# Altium project MiniPC MB GOST.PrjPcb (part 30 of 31)
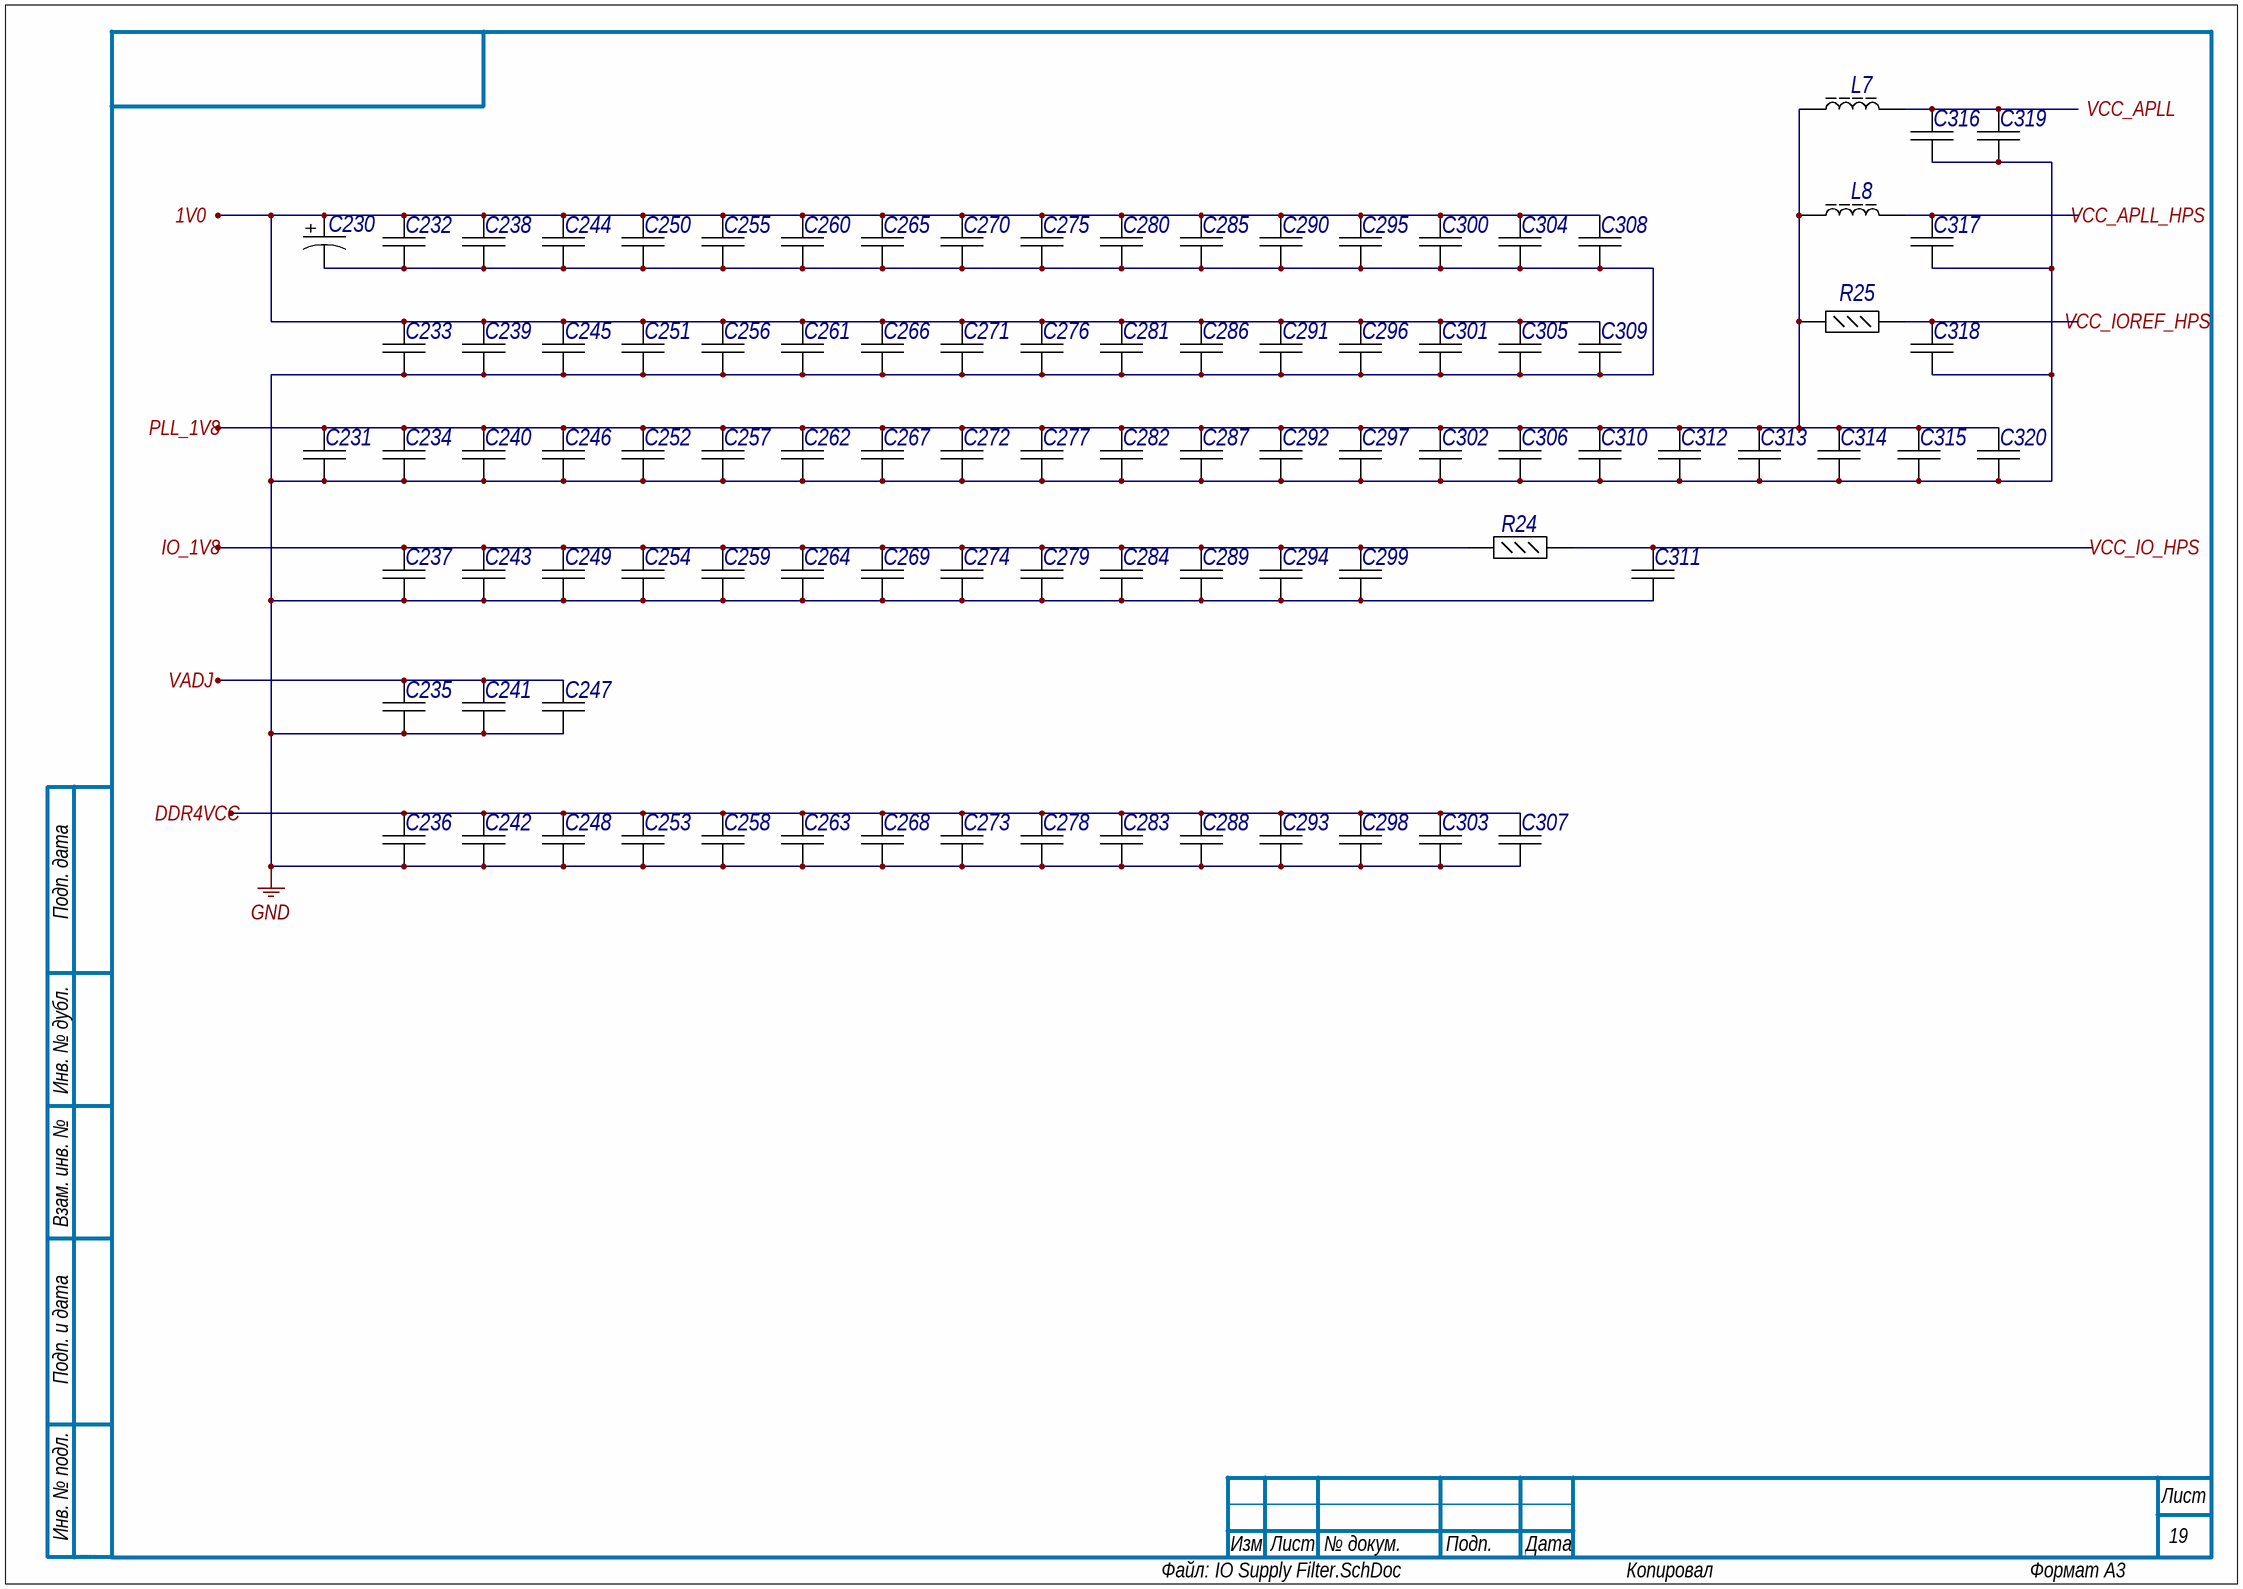
[diagram p57: IO Supply Filter.SchDoc]

## Sheet IO Supply Filter.SchDoc (continued)

### Library data of the parts (continued)
C320 = E22: Chip Capacitor, 100 nF, +/- 10%, 6.3 V, -55 to 85 degC, 0201 (0603 Metric), RoHS, Tape and Reel; Manufacturer: Basic Passives; Тип элемента: Конденсатор; Capacitance: 100 nF; Case\/Package: 0201; Type (Capacitors): X5R; Voltage Rating: 6.3 V; Voltage Rating (DC): 3 V; Old_des: C444; New_des: C320; UID: E22; Component Kind: Standard; Case Code (Imperial): 0201; Case Code (Metric): 0603; ComponentLink1Description: Manufacturer URL; ComponentLink1URL: http://www.murata.com/; ComponentLink2Description: Datasheet; ComponentLink2URL: http://search.murata.co.jp/Ceramy/image/img/A01X/G101/ENG/GRM033R60J104KE19-01.pdf; DatasheetVersion: 03/2016; Length: 0.6 mm; Max Operating Temperature: 85 degC; Min Operating Temperature: -55 degC; Mounting Technology: Surface Mount; Package Quantity: 15000; PackageDescription: 2-Pin Surface Mount Device, Body 0.6 x 0.3 mm; Packaging: Tape and Reel; PartNumber: GRM033R60J104KE19D; RoHSCompliant: true; Tolerance: 10%; Width: 0.3 mm; Height: 0.3 mm; Mount: Surface Mount; PackageReference: 0201; Pins: 2; Radiation Hardening: No; REACH SVHC: No SVHC
L7 = E45: SMD EMI Suppression Ferrite Bead WE-CBF, Z = 30 Ohm; Тип элемента: Ферритовый дроссель; Impedance: 30 Ohm; Old_des: L15; New_des: L7; UID: E45; Component Kind: Standard; ComponentLink1Description: Manufacturer Link; ComponentLink1URL: http://www.we-online.com; ComponentLink2Description: Datasheet; ComponentLink2URL: http://www.we-online.de/katalog/media/pdf/742792609.pdf; DatasheetVersion: Dec-2005; PackageDescription: Chip Inductor, 2-Leads, Body 1.6 x 0.8 mm; PackageReference: SMD-0603; PackageVersion: 2009
L8 = E45: SMD EMI Suppression Ferrite Bead WE-CBF, Z = 30 Ohm; Тип элемента: Ферритовый дроссель; Impedance: 30 Ohm; Old_des: L16; New_des: L8; UID: E45; Component Kind: Standard; ComponentLink1Description: Manufacturer Link; ComponentLink1URL: http://www.we-online.com; ComponentLink2Description: Datasheet; ComponentLink2URL: http://www.we-online.de/katalog/media/pdf/742792609.pdf; DatasheetVersion: Dec-2005; PackageDescription: Chip Inductor, 2-Leads, Body 1.6 x 0.8 mm; PackageReference: SMD-0603; PackageVersion: 2009
R24 = E64: Chip Resistor, 0 mOhm, +/- 5%, 100 mW, -55 to 155 degC, 0402 (1005 Metric), RoHS, Tape and Reel; Manufacturer: Basic Passives; Тип элемента: Резистор; Case\/Package: 0402; Voltage Rating: 50 V; Power Rating: 100 mW; Resistance: 0 mOhm; Old_des: R326; New_des: R24; UID: E64; Component Kind: Standard; Case Code (Imperial): 0402; Case Code (Metric): 1005; ComponentLink1Description: Manufacturer URL; ComponentLink1URL: http://www.panasonic.com/; ComponentLink2Description: Datasheet; ComponentLink2URL: http://industrial.panasonic.com/cdbs/www-data/pdf/RDA0000/AOA0000C84.pdf; DatasheetVersion: 03/2015; Length: 1 mm; Max Operating Temperature: 155 degC; Min Operating Temperature: -55 degC; Mounting Technology: Surface Mount; Package Quantity: 10000; PackageDescription: 2-Pin Surface Mount Device, Body 1 x 0.5 mm; Packaging: Tape and Reel; PartNumber: ERJ-2GE0R00X; RoHSCompliant: true; Tolerance: 5%; Width: 0.5 mm; Height: 0.35 mm; Mount: Surface Mount; PackageReference: 0402; Pins: 2; Radiation Hardening: No; REACH SVHC: Unknown
R25 = E64: Chip Resistor, 0 mOhm, +/- 5%, 100 mW, -55 to 155 degC, 0402 (1005 Metric), RoHS, Tape and Reel; Manufacturer: Basic Passives; Тип элемента: Резистор; Case\/Package: 0402; Voltage Rating: 50 V; Power Rating: 100 mW; Resistance: 0 mOhm; Old_des: R327; New_des: R25; UID: E64; Component Kind: Standard; Case Code (Imperial): 0402; Case Code (Metric): 1005; ComponentLink1Description: Manufacturer URL; ComponentLink1URL: http://www.panasonic.com/; ComponentLink2Description: Datasheet; ComponentLink2URL: http://industrial.panasonic.com/cdbs/www-data/pdf/RDA0000/AOA0000C84.pdf; DatasheetVersion: 03/2015; Length: 1 mm; Max Operating Temperature: 155 degC; Min Operating Temperature: -55 degC; Mounting Technology: Surface Mount; Package Quantity: 10000; PackageDescription: 2-Pin Surface Mount Device, Body 1 x 0.5 mm; Packaging: Tape and Reel; PartNumber: ERJ-2GE0R00X; RoHSCompliant: true; Tolerance: 5%; Width: 0.5 mm; Height: 0.35 mm; Mount: Surface Mount; PackageReference: 0402; Pins: 2; Radiation Hardening: No; REACH SVHC: Unknown

## Sheet P_RAM_integr.SchDoc
size 420 x 297 mm; Author: ALTIUM GOSTBOM2.0 KEV; SheetNumber: 27; SheetTotal: 48
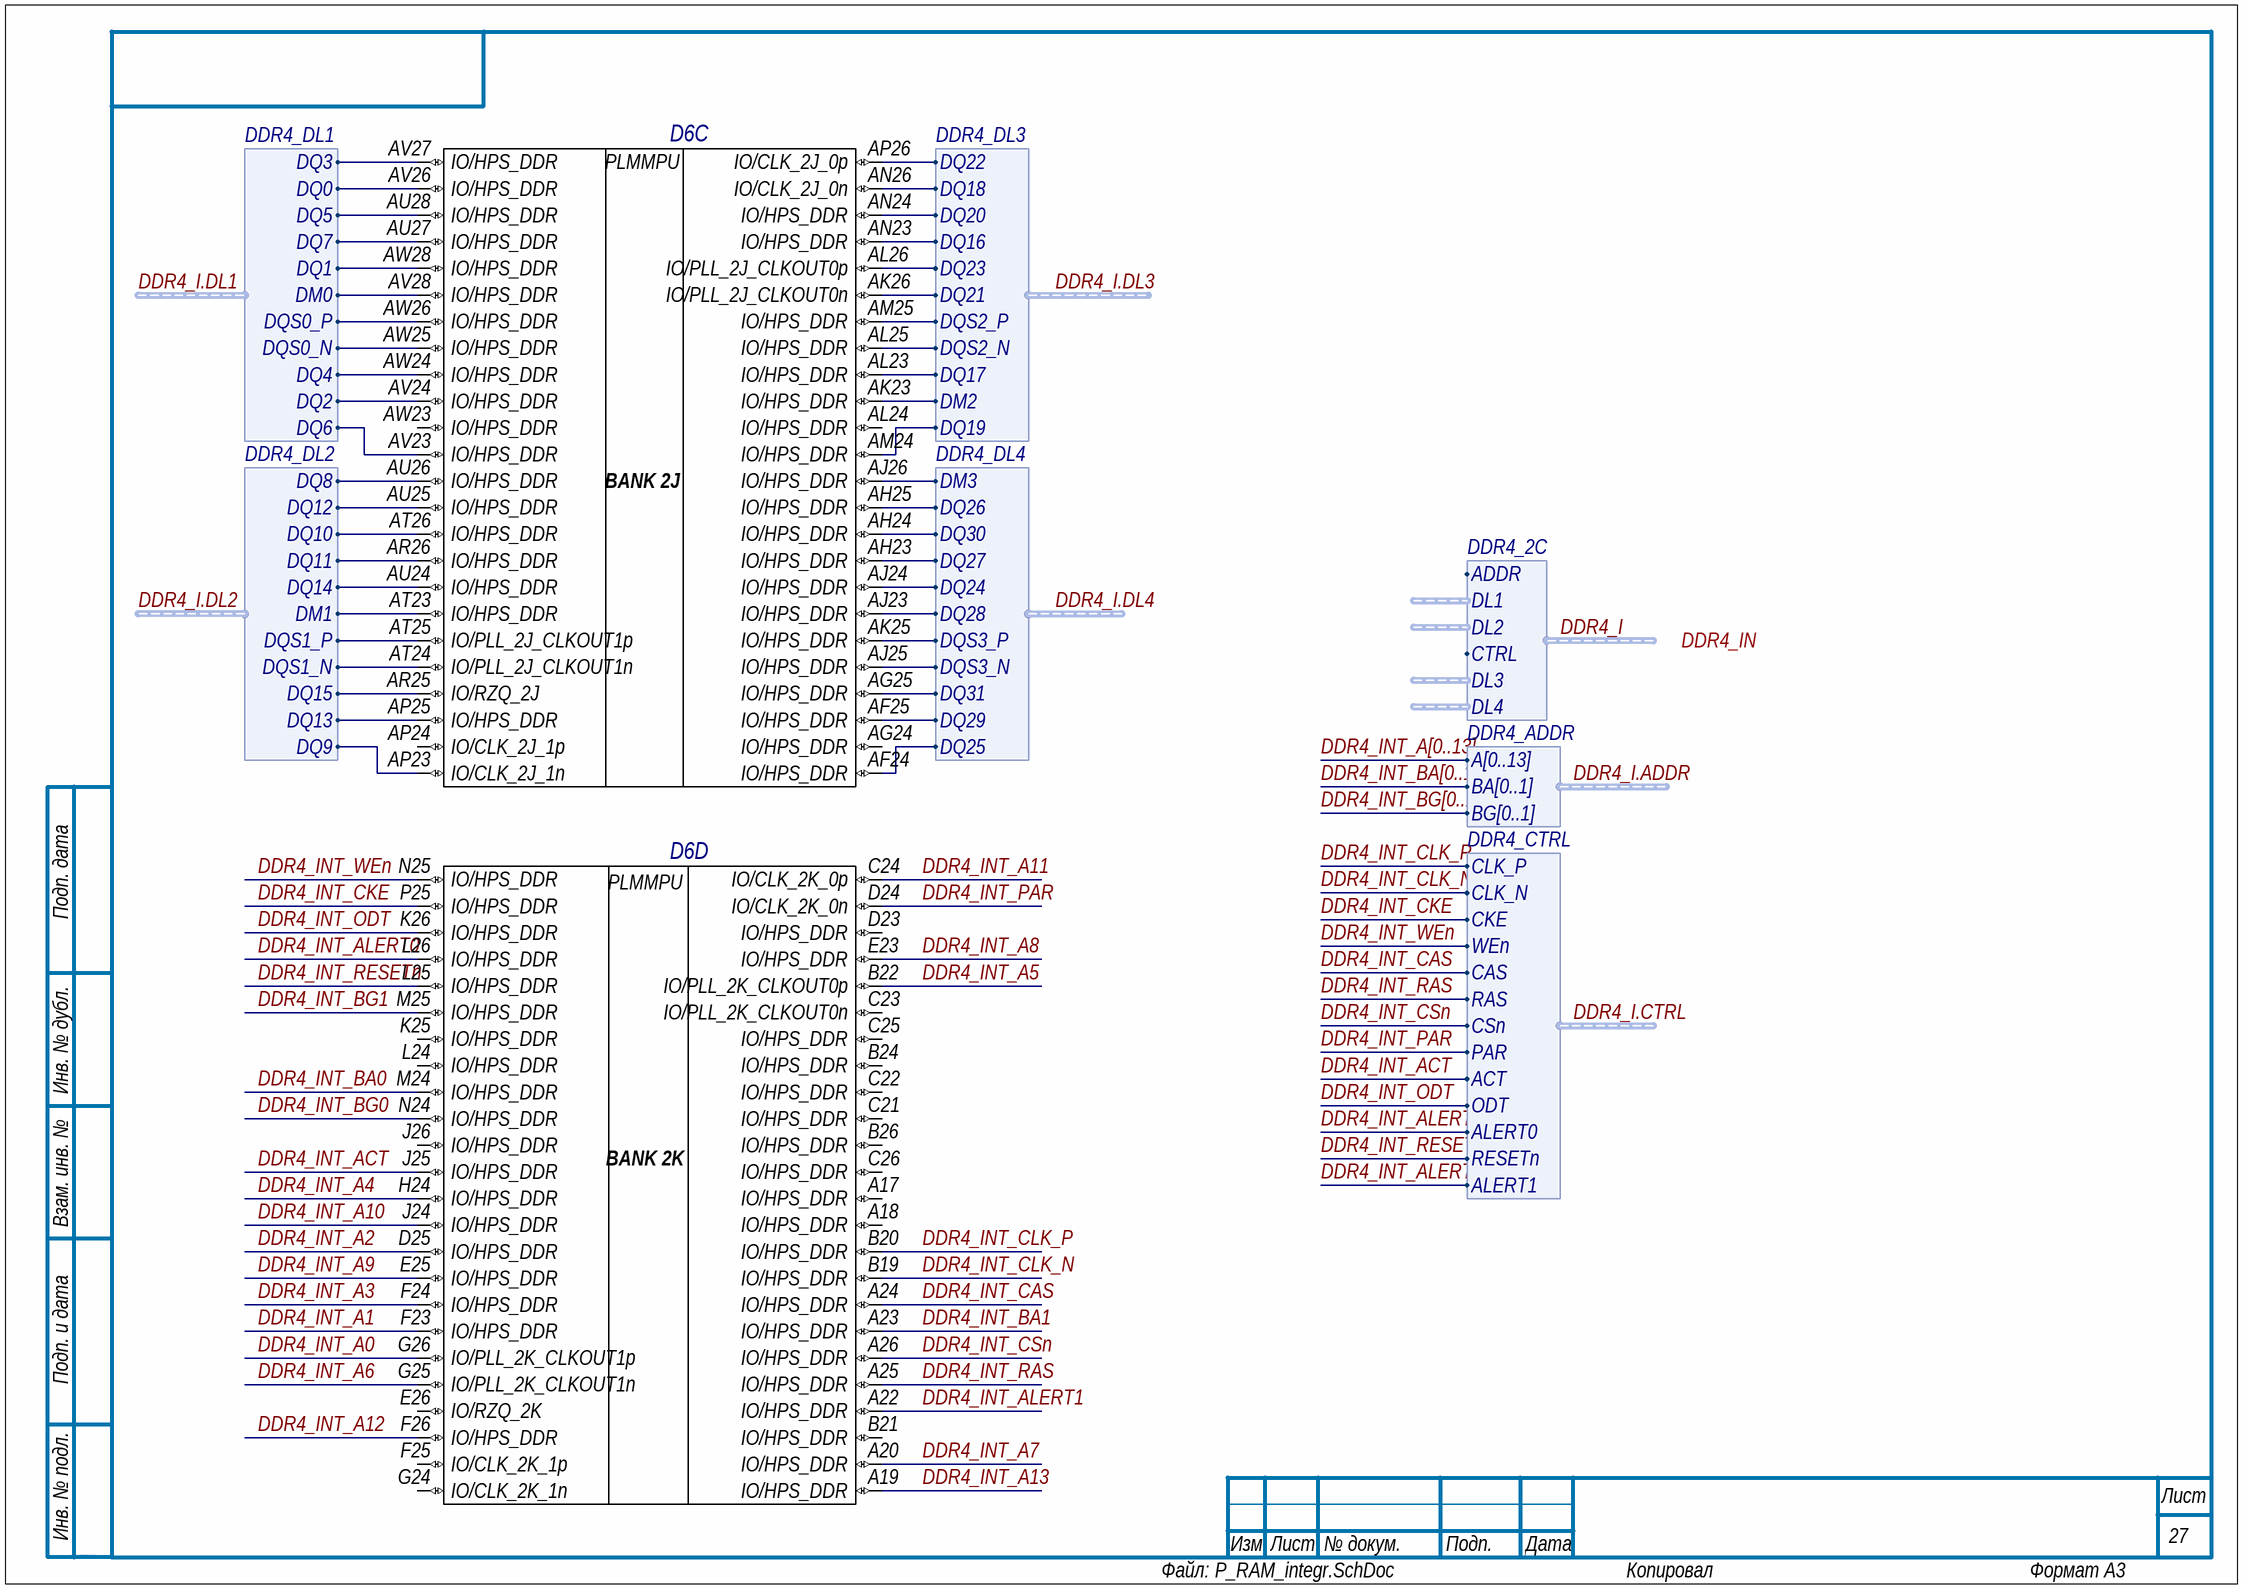
[diagram p37: P_RAM_integr.SchDoc]

### Parts
D6  10AS066N3F40E2SGE2  [ALTR-FBGA1517_A-350]  (value not drawn)  (parts C,D of 39)

### Ports
DDR4_IN (harness DDR4_2C)

### Harnesses
DDR4_2C: ADDR, DL1, DL2, CTRL, DL3, DL4
DDR4_ADDR: A[0..13], BA[0..1], BG[0..1]
DDR4_CTRL: CLK_P, CLK_N, CKE, WEn, CAS, RAS, CSn, PAR, ACT, ODT, ALERT0, RESETn, ALERT1
DDR4_DL1: DQ0, DQ1, DQ2, DQ3, DQ4, DQ5, DQ6, DQ7, DM0, DQS0_P, DQS0_N
DDR4_DL2: DQ8, DQ9, DQ10, DQ11, DQ12, DQ13, DQ14, DQ15, DM1, DQS1_P, DQS1_N
DDR4_DL3: DQ16, DQ17, DQ18, DQ19, DQ20, DQ21, DQ22, DQ23, DM2, DQS2_P, DQS2_N
DDR4_DL4: DQ24, DQ25, DQ26, DQ27, DQ28, DQ29, DQ30, DQ31, DM3, DQS3_P, DQS3_N

### Nets
DDR4_I.DL1.DM0: D6.AV28(IO/HPS_DDR) ; harness DDR4_DL1.DM0
DDR4_I.DL1.DQ0: D6.AV26(IO/HPS_DDR) ; harness DDR4_DL1.DQ0
DDR4_I.DL1.DQ1: D6.AW28(IO/HPS_DDR) ; harness DDR4_DL1.DQ1
DDR4_I.DL1.DQ2: D6.AV24(IO/HPS_DDR) ; harness DDR4_DL1.DQ2
DDR4_I.DL1.DQ3: D6.AV27(IO/HPS_DDR) ; harness DDR4_DL1.DQ3
DDR4_I.DL1.DQ4: D6.AW24(IO/HPS_DDR) ; harness DDR4_DL1.DQ4
DDR4_I.DL1.DQ5: D6.AU28(IO/HPS_DDR) ; harness DDR4_DL1.DQ5
DDR4_I.DL1.DQ6: D6.AV23(IO/HPS_DDR) ; harness DDR4_DL1.DQ6
DDR4_I.DL1.DQ7: D6.AU27(IO/HPS_DDR) ; harness DDR4_DL1.DQ7
DDR4_I.DL1.DQS0_N: D6.AW25(IO/HPS_DDR) ; harness DDR4_DL1.DQS0_N
DDR4_I.DL1.DQS0_P: D6.AW26(IO/HPS_DDR) ; harness DDR4_DL1.DQS0_P
DDR4_I.DL2.DM1: D6.AT23(IO/HPS_DDR) ; harness DDR4_DL2.DM1
DDR4_I.DL2.DQ8: D6.AU26(IO/HPS_DDR) ; harness DDR4_DL2.DQ8
DDR4_I.DL2.DQ9: D6.AP23(IO/CLK_2J_1n) ; harness DDR4_DL2.DQ9
DDR4_I.DL2.DQ10: D6.AT26(IO/HPS_DDR) ; harness DDR4_DL2.DQ10
DDR4_I.DL2.DQ11: D6.AR26(IO/HPS_DDR) ; harness DDR4_DL2.DQ11
DDR4_I.DL2.DQ12: D6.AU25(IO/HPS_DDR) ; harness DDR4_DL2.DQ12
DDR4_I.DL2.DQ13: D6.AP25(IO/HPS_DDR) ; harness DDR4_DL2.DQ13
DDR4_I.DL2.DQ14: D6.AU24(IO/HPS_DDR) ; harness DDR4_DL2.DQ14
DDR4_I.DL2.DQ15: D6.AR25(IO/RZQ_2J) ; harness DDR4_DL2.DQ15
DDR4_I.DL2.DQS1_N: D6.AT24(IO/PLL_2J_CLKOUT1n) ; harness DDR4_DL2.DQS1_N
DDR4_I.DL2.DQS1_P: D6.AT25(IO/PLL_2J_CLKOUT1p) ; harness DDR4_DL2.DQS1_P
DDR4_I.DL3.DM2: D6.AK23(IO/HPS_DDR) ; harness DDR4_DL3.DM2
DDR4_I.DL3.DQ16: D6.AN23(IO/HPS_DDR) ; harness DDR4_DL3.DQ16
DDR4_I.DL3.DQ17: D6.AL23(IO/HPS_DDR) ; harness DDR4_DL3.DQ17
DDR4_I.DL3.DQ18: D6.AN26(IO/CLK_2J_0n) ; harness DDR4_DL3.DQ18
DDR4_I.DL3.DQ19: D6.AM24(IO/HPS_DDR) ; harness DDR4_DL3.DQ19
DDR4_I.DL3.DQ20: D6.AN24(IO/HPS_DDR) ; harness DDR4_DL3.DQ20
DDR4_I.DL3.DQ21: D6.AK26(IO/PLL_2J_CLKOUT0n) ; harness DDR4_DL3.DQ21
DDR4_I.DL3.DQ22: D6.AP26(IO/CLK_2J_0p) ; harness DDR4_DL3.DQ22
DDR4_I.DL3.DQ23: D6.AL26(IO/PLL_2J_CLKOUT0p) ; harness DDR4_DL3.DQ23
DDR4_I.DL3.DQS2_N: D6.AL25(IO/HPS_DDR) ; harness DDR4_DL3.DQS2_N
DDR4_I.DL3.DQS2_P: D6.AM25(IO/HPS_DDR) ; harness DDR4_DL3.DQS2_P
DDR4_I.DL4.DM3: D6.AJ26(IO/HPS_DDR) ; harness DDR4_DL4.DM3
DDR4_I.DL4.DQ24: D6.AJ24(IO/HPS_DDR) ; harness DDR4_DL4.DQ24
DDR4_I.DL4.DQ25: D6.AF24(IO/HPS_DDR) ; harness DDR4_DL4.DQ25
DDR4_I.DL4.DQ26: D6.AH25(IO/HPS_DDR) ; harness DDR4_DL4.DQ26
DDR4_I.DL4.DQ27: D6.AH23(IO/HPS_DDR) ; harness DDR4_DL4.DQ27
DDR4_I.DL4.DQ28: D6.AJ23(IO/HPS_DDR) ; harness DDR4_DL4.DQ28
DDR4_I.DL4.DQ29: D6.AF25(IO/HPS_DDR) ; harness DDR4_DL4.DQ29
DDR4_I.DL4.DQ30: D6.AH24(IO/HPS_DDR) ; harness DDR4_DL4.DQ30
DDR4_I.DL4.DQ31: D6.AG25(IO/HPS_DDR) ; harness DDR4_DL4.DQ31
DDR4_I.DL4.DQS3_N: D6.AJ25(IO/HPS_DDR) ; harness DDR4_DL4.DQS3_N
DDR4_I.DL4.DQS3_P: D6.AK25(IO/HPS_DDR) ; harness DDR4_DL4.DQS3_P
DDR4_INT_A0: D6.G26(IO/PLL_2K_CLKOUT1p)  [project net DDR4_INT_A0_27]
DDR4_INT_A1: D6.F23(IO/HPS_DDR)  [project net DDR4_INT_A1_27]
DDR4_INT_A2: D6.D25(IO/HPS_DDR)  [project net DDR4_INT_A2_27]
DDR4_INT_A3: D6.F24(IO/HPS_DDR)  [project net DDR4_INT_A3_27]
DDR4_INT_A4: D6.H24(IO/HPS_DDR)  [project net DDR4_INT_A4_27]
DDR4_INT_A5: D6.B22(IO/PLL_2K_CLKOUT0p)  [project net DDR4_INT_A5_27]
DDR4_INT_A6: D6.G25(IO/PLL_2K_CLKOUT1n)  [project net DDR4_INT_A6_27]
DDR4_INT_A7: D6.A20(IO/HPS_DDR)  [project net DDR4_INT_A7_27]
DDR4_INT_A8: D6.E23(IO/HPS_DDR)  [project net DDR4_INT_A8_27]
DDR4_INT_A9: D6.E25(IO/HPS_DDR)  [project net DDR4_INT_A9_27]
DDR4_INT_A10: D6.J24(IO/HPS_DDR)  [project net DDR4_INT_A10_27]
DDR4_INT_A11: D6.C24(IO/CLK_2K_0p)  [project net DDR4_INT_A11_27]
DDR4_INT_A12: D6.F26(IO/HPS_DDR)  [project net DDR4_INT_A12_27]
DDR4_INT_A13: D6.A19(IO/HPS_DDR)  [project net DDR4_INT_A13_27]
DDR4_INT_ACT: D6.J25(IO/HPS_DDR) ; harness DDR4_CTRL.ACT  [project net DDR4_I.CTRL.ACT]
DDR4_INT_ALERT0: D6.L26(IO/HPS_DDR) ; harness DDR4_CTRL.ALERT0  [project net DDR4_I.CTRL.ALERT0]
DDR4_INT_ALERT1: D6.A22(IO/HPS_DDR) ; harness DDR4_CTRL.ALERT1  [project net DDR4_I.CTRL.ALERT1]
DDR4_INT_BA0: D6.M24(IO/HPS_DDR)  [project net DDR4_INT_BA0_27]
DDR4_INT_BA1: D6.A23(IO/HPS_DDR)  [project net DDR4_INT_BA1_27]
DDR4_INT_BG0: D6.N24(IO/HPS_DDR)  [project net DDR4_INT_BG0_27]
DDR4_INT_BG1: D6.M25(IO/HPS_DDR)  [project net DDR4_INT_BG1_27]
DDR4_INT_CAS: D6.A24(IO/HPS_DDR) ; harness DDR4_CTRL.CAS  [project net DDR4_I.CTRL.CAS]
DDR4_INT_CKE: D6.P25(IO/HPS_DDR) ; harness DDR4_CTRL.CKE  [project net DDR4_I.CTRL.CKE]
DDR4_INT_CLK_N: D6.B19(IO/HPS_DDR) ; harness DDR4_CTRL.CLK_N  [project net DDR4_I.CTRL.CLK_N]
DDR4_INT_CLK_P: D6.B20(IO/HPS_DDR) ; harness DDR4_CTRL.CLK_P  [project net DDR4_I.CTRL.CLK_P]
DDR4_INT_CSn: D6.A26(IO/HPS_DDR) ; harness DDR4_CTRL.CSn  [project net DDR4_I.CTRL.CSn]
DDR4_INT_ODT: D6.K26(IO/HPS_DDR) ; harness DDR4_CTRL.ODT  [project net DDR4_I.CTRL.ODT]
DDR4_INT_PAR: D6.D24(IO/CLK_2K_0n) ; harness DDR4_CTRL.PAR  [project net DDR4_I.CTRL.PAR]
DDR4_INT_RAS: D6.A25(IO/HPS_DDR) ; harness DDR4_CTRL.RAS  [project net DDR4_I.CTRL.RAS]
DDR4_INT_RESETn: D6.L25(IO/HPS_DDR) ; harness DDR4_CTRL.RESETn  [project net DDR4_I.CTRL.RESETn]
DDR4_INT_WEn: D6.N25(IO/HPS_DDR) ; harness DDR4_CTRL.WEn  [project net DDR4_I.CTRL.WEn]

Not connected (* = marked no-connect by the designer): D6 A17(IO/HPS_DDR) A18(IO/HPS_DDR) AG24(IO/HPS_DDR) AL24(IO/HPS_DDR) AP24(IO/CLK_2J_1p) AW23(IO/HPS_DDR) B21(IO/HPS_DDR) B24(IO/HPS_DDR) B26(IO/HPS_DDR) C21(IO/HPS_DDR) C22(IO/HPS_DDR) C23(IO/PLL_2K_CLKOUT0n) C25(IO/HPS_DDR) C26(IO/HPS_DDR) D23(IO/HPS_DDR) E26(IO/RZQ_2K) F25(IO/CLK_2K_1p) G24(IO/CLK_2K_1n) J26(IO/HPS_DDR) K25(IO/HPS_DDR) L24(IO/HPS_DDR)

### Buses and harness runs
bus DDR4_INT_A[0..13]
bus DDR4_INT_BA[0..1]
bus DDR4_INT_BG[0..1]
harness DDR4_I = port DDR4_IN

### Notes on the sheet
- Подп. дата
- Инв. № дубл.
- Взам. инв. №
- Подп. и дата
- Инв. № подл.
- Изм.
- Лист
- № докум.
- Подп.
- Дата
- ALTIUM GOSTBOM2.0 KEV
- Файл:
- Копировал
- Формат А3
- (in symbol E105, part C) PLMMPU; BANK 2J
- (in symbol E105, part D) PLMMPU; BANK 2K

### Library data of the parts
D6 = E105: Arria 10 SX Family, 588 I/O Pins, 16 Fractional PLLs, 1517-Pin FBGA, Speed Grade 2, Extended Grade, RoHS; Тип элемента: ПЛИС; Old_des: U1; New_des: D6; UID: E105; Component Kind: Standard; ComponentLink1Description: Manufacturer URL; ComponentLink1URL: https://www.altera.com/; ComponentLink2Description: Datasheet; ComponentLink2URL: https://www.altera.com/content/dam/altera-www/global/en_US/pdfs/literature/hb/arria-10/a10_datasheet.pdf; DatasheetVersion: Rev. 2016-06-24, 06/2016; Mounting Technology: Surface Mount; PackageDescription: 1517-Pin FineLine Ball-Grid Array (FBGA), Body 40 x 40 mm, Pitch 1 mm; PartNumber: 10AS066N3F40E2SGE2; Code_JEDEC: MS-034; ComponentLink3Description: Package Specification; ComponentLink3URL: https://www.altera.com/content/dam/altera-www/global/en_US/pdfs/literature/packaging/04r00461-04.pdf; PackageVersion: Rev. 5.0, 01/2016

## Sheet P_RAM_aux.SchDoc
size 594 x 420 mm; Author: ALTIUM GOSTBOM2.0 KEV; SheetNumber: 26; SheetTotal: 48
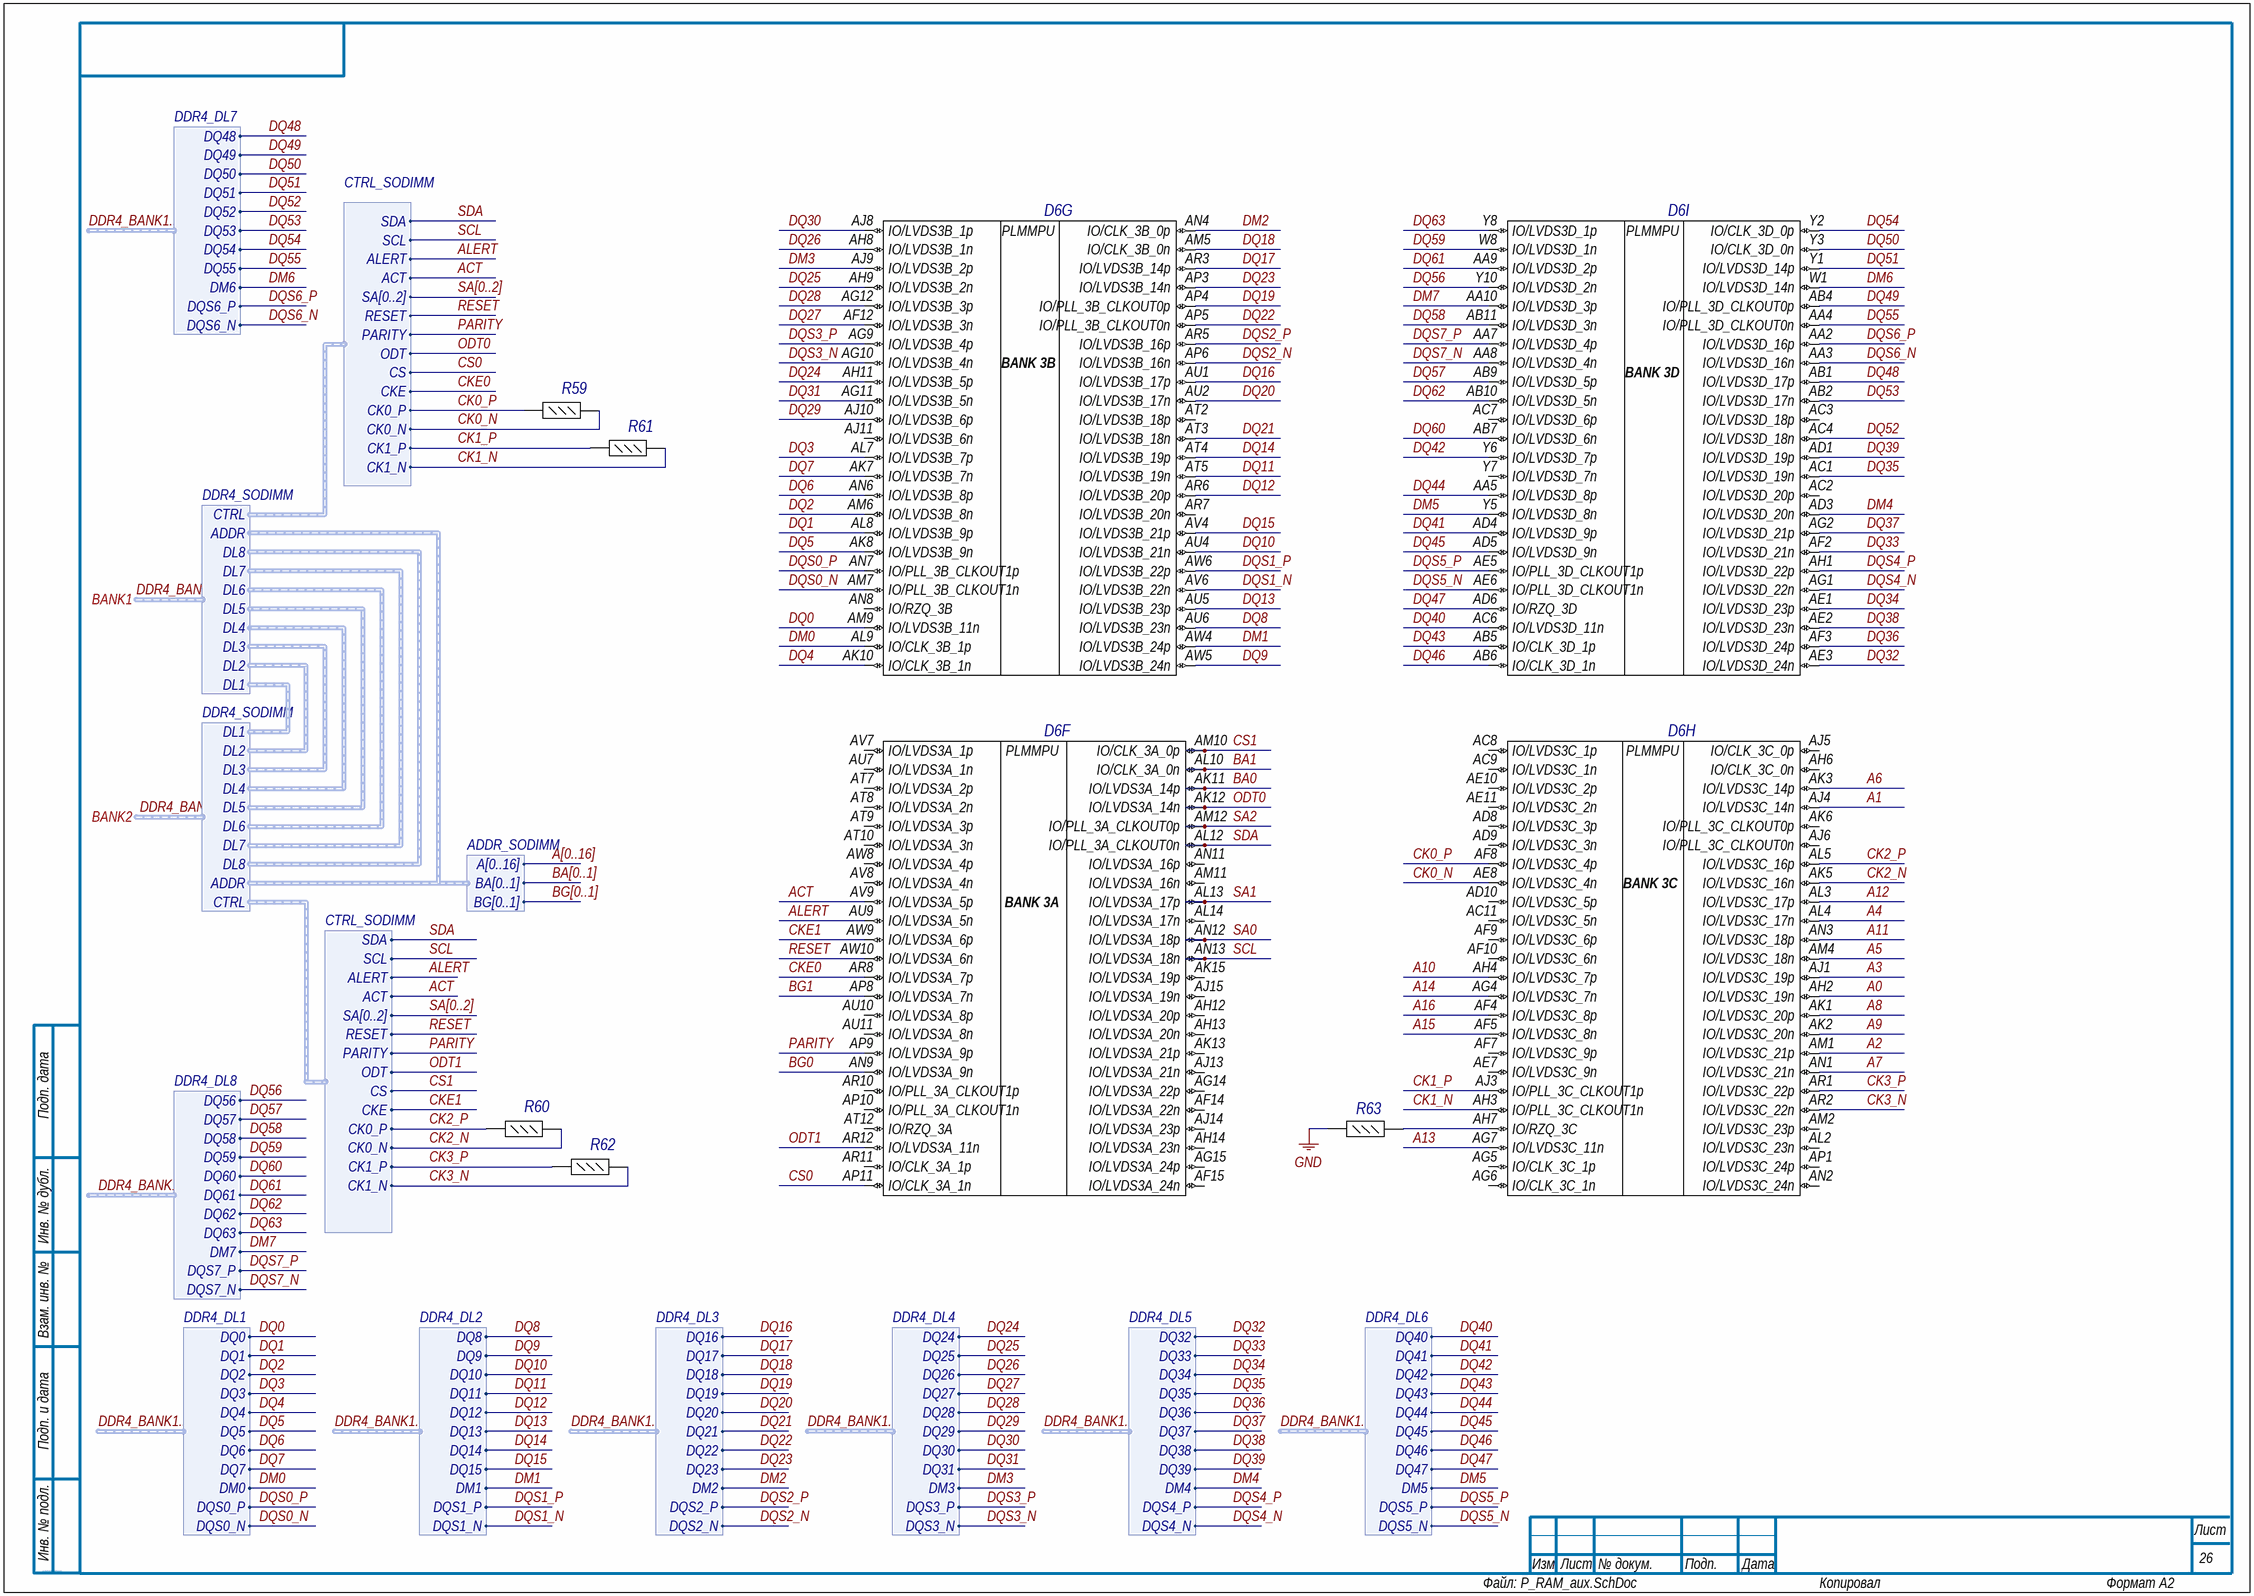
[diagram p38: P_RAM_aux.SchDoc]

### Parts
D6  10AS066N3F40E2SGE2  [ALTR-FBGA1517_A-350]  (value not drawn)  (parts F,G,H,I of 39)
R59  RC0402JR-0739RL  [RESC1005X40X25LL05T05]  (value not drawn)
R60  RC0402JR-0739RL  [RESC1005X40X25LL05T05]  (value not drawn)
R61  RC0402JR-0739RL  [RESC1005X40X25LL05T05]  (value not drawn)
R62  RC0402JR-0739RL  [RESC1005X40X25LL05T05]  (value not drawn)
R63  RC0402JR-0739RL  [RESC1005X40X25LL05T05]  (value not drawn)

### Ports
BANK1 (harness DDR4_SODIMM), BANK2 (harness DDR4_SODIMM)

### Harnesses
DDR4_SODIMM: CTRL, ADDR, DL1, DL2, DL3, DL4, DL5, DL6, DL7, DL8
ADDR_SODIMM: A[0..16], BA[0..1], BG[0..1]
CTRL_SODIMM: SDA, SCL, SA[0..2], RESET, PARITY, ODT, CS, CKE, CK1_P, CK1_N, CK0_P, CK0_N, ALERT, ACT
DDR4_DL1: DQ0, DQ1, DQ2, DQ3, DQ4, DQ5, DQ6, DQ7, DM0, DQS0_P, DQS0_N
DDR4_DL2: DQ8, DQ9, DQ10, DQ11, DQ12, DQ13, DQ14, DQ15, DM1, DQS1_P, DQS1_N
DDR4_DL3: DQ16, DQ17, DQ18, DQ19, DQ20, DQ21, DQ22, DQ23, DM2, DQS2_P, DQS2_N
DDR4_DL5: DQ32, DQ33, DQ34, DQ35, DQ36, DQ37, DQ38, DQ39, DM4, DQS4_P, DQS4_N
DDR4_DL4: DQ24, DQ25, DQ26, DQ27, DQ28, DQ29, DQ30, DQ31, DM3, DQS3_P, DQS3_N
DDR4_DL6: DQ40, DQ41, DQ42, DQ43, DQ44, DQ45, DQ46, DQ47, DM5, DQS5_P, DQS5_N
DDR4_DL7: DQ48, DQ49, DQ50, DQ51, DQ52, DQ53, DQ54, DQ55, DM6, DQS6_P, DQS6_N
DDR4_DL8: DQ56, DQ57, DQ58, DQ59, DQ60, DQ61, DQ62, DQ63, DM7, DQS7_P, DQS7_N

### Nets
GND: R63.1
A0: D6.AH2(IO/LVDS3C_19n)  [project net A0_26]
A1: D6.AJ4(IO/LVDS3C_14n)  [project net A1_26]
A2: D6.AM1(IO/LVDS3C_21p)  [project net A2_26]
A3: D6.AJ1(IO/LVDS3C_19p)  [project net A3_26]
A4: D6.AL4(IO/LVDS3C_17n)  [project net A4_26]
A5: D6.AM4(IO/LVDS3C_18n)  [project net A5_26]
A6: D6.AK3(IO/LVDS3C_14p)  [project net A6_26]
A7: D6.AN1(IO/LVDS3C_21n)  [project net A7_26]
A8: D6.AK1(IO/LVDS3C_20p)  [project net A8_26]
A9: D6.AK2(IO/LVDS3C_20n)  [project net A9_26]
A10: D6.AH4(IO/LVDS3C_7p)  [project net A10_26]
A11: D6.AN3(IO/LVDS3C_18p)  [project net A11_26]
A12: D6.AL3(IO/LVDS3C_17p)  [project net A12_26]
A13: D6.AG7(IO/LVDS3C_11n)  [project net A13_26]
A14: D6.AG4(IO/LVDS3C_7n)  [project net A14_26]
A15: D6.AF5(IO/LVDS3C_8n)  [project net A15_26]
A16: D6.AF4(IO/LVDS3C_8p)  [project net A16_26]
ACT: D6.AV9(IO/LVDS3A_5p) ; harness CTRL_SODIMM.ACT
ALERT: D6.AU9(IO/LVDS3A_5n) ; harness CTRL_SODIMM.ALERT
BA0: D6.AK11(IO/LVDS3A_14p)  [project net BA0_26]
BA1: D6.AL10(IO/CLK_3A_0n)  [project net BA1_26]
BG0: D6.AN9(IO/LVDS3A_9n)  [project net BG0_26]
BG1: D6.AP8(IO/LVDS3A_7n)  [project net BG1_26]
CK0_N: D6.AE8(IO/LVDS3C_4n) R59.2 ; harness CTRL_SODIMM.CK0_N
CK0_P: D6.AF8(IO/LVDS3C_4p) R59.1 ; harness CTRL_SODIMM.CK0_P
CK1_N: D6.AH3(IO/PLL_3C_CLKOUT1n) R61.2 ; harness CTRL_SODIMM.CK1_N
CK1_P: D6.AJ3(IO/PLL_3C_CLKOUT1p) R61.1 ; harness CTRL_SODIMM.CK1_P
CK2_N: D6.AK5(IO/LVDS3C_16n) R60.2 ; harness CTRL_SODIMM.CK0_N
CK2_P: D6.AL5(IO/LVDS3C_16p) R60.1 ; harness CTRL_SODIMM.CK0_P
CK3_N: D6.AR2(IO/LVDS3C_22n) R62.2 ; harness CTRL_SODIMM.CK1_N
CK3_P: D6.AR1(IO/LVDS3C_22p) R62.1 ; harness CTRL_SODIMM.CK1_P
CKE0: D6.AR8(IO/LVDS3A_7p) ; harness CTRL_SODIMM.CKE
CKE1: D6.AW9(IO/LVDS3A_6p) ; harness CTRL_SODIMM.CKE
CS0: D6.AP11(IO/CLK_3A_1n) ; harness CTRL_SODIMM.CS
CS1: D6.AM10(IO/CLK_3A_0p) ; harness CTRL_SODIMM.CS
DM0: D6.AL9(IO/CLK_3B_1p) ; harness DDR4_DL1.DM0  [project net DDR4_BANK1.DL1.DM0]
DM1: D6.AW4(IO/LVDS3B_24p) ; harness DDR4_DL2.DM1  [project net DDR4_BANK1.DL2.DM1]
DM2: D6.AN4(IO/CLK_3B_0p) ; harness DDR4_DL3.DM2  [project net DDR4_BANK1.DL3.DM2]
DM3: D6.AJ9(IO/LVDS3B_2p) ; harness DDR4_DL4.DM3  [project net DDR4_BANK1.DL4.DM3]
DM4: D6.AD3(IO/LVDS3D_20n) ; harness DDR4_DL5.DM4  [project net DDR4_BANK1.DL5.DM4]
DM5: D6.Y5(IO/LVDS3D_8n) ; harness DDR4_DL6.DM5  [project net DDR4_BANK1.DL6.DM5]
DM6: D6.W1(IO/LVDS3D_14n) ; harness DDR4_DL7.DM6  [project net DDR4_BANK1.DL7.DM6]
DM7: D6.AA10(IO/LVDS3D_3p) ; harness DDR4_DL8.DM7  [project net DDR4_BANK1.DL8.DM7]
DQ0: D6.AM9(IO/LVDS3B_11n) ; harness DDR4_DL1.DQ0  [project net DDR4_BANK1.DL1.DQ0]
DQ1: D6.AL8(IO/LVDS3B_9p) ; harness DDR4_DL1.DQ1  [project net DDR4_BANK1.DL1.DQ1]
DQ2: D6.AM6(IO/LVDS3B_8n) ; harness DDR4_DL1.DQ2  [project net DDR4_BANK1.DL1.DQ2]
DQ3: D6.AL7(IO/LVDS3B_7p) ; harness DDR4_DL1.DQ3  [project net DDR4_BANK1.DL1.DQ3]
DQ4: D6.AK10(IO/CLK_3B_1n) ; harness DDR4_DL1.DQ4  [project net DDR4_BANK1.DL1.DQ4]
DQ5: D6.AK8(IO/LVDS3B_9n) ; harness DDR4_DL1.DQ5  [project net DDR4_BANK1.DL1.DQ5]
DQ6: D6.AN6(IO/LVDS3B_8p) ; harness DDR4_DL1.DQ6  [project net DDR4_BANK1.DL1.DQ6]
DQ7: D6.AK7(IO/LVDS3B_7n) ; harness DDR4_DL1.DQ7  [project net DDR4_BANK1.DL1.DQ7]
DQ8: D6.AU6(IO/LVDS3B_23n) ; harness DDR4_DL2.DQ8  [project net DDR4_BANK1.DL2.DQ8]
DQ9: D6.AW5(IO/LVDS3B_24n) ; harness DDR4_DL2.DQ9  [project net DDR4_BANK1.DL2.DQ9]
DQ10: D6.AU4(IO/LVDS3B_21n) ; harness DDR4_DL2.DQ10  [project net DDR4_BANK1.DL2.DQ10]
DQ11: D6.AT5(IO/LVDS3B_19n) ; harness DDR4_DL2.DQ11  [project net DDR4_BANK1.DL2.DQ11]
DQ12: D6.AR6(IO/LVDS3B_20p) ; harness DDR4_DL2.DQ12  [project net DDR4_BANK1.DL2.DQ12]
DQ13: D6.AU5(IO/LVDS3B_23p) ; harness DDR4_DL2.DQ13  [project net DDR4_BANK1.DL2.DQ13]
DQ14: D6.AT4(IO/LVDS3B_19p) ; harness DDR4_DL2.DQ14  [project net DDR4_BANK1.DL2.DQ14]
DQ15: D6.AV4(IO/LVDS3B_21p) ; harness DDR4_DL2.DQ15  [project net DDR4_BANK1.DL2.DQ15]
DQ16: D6.AU1(IO/LVDS3B_17p) ; harness DDR4_DL3.DQ16  [project net DDR4_BANK1.DL3.DQ16]
DQ17: D6.AR3(IO/LVDS3B_14p) ; harness DDR4_DL3.DQ17  [project net DDR4_BANK1.DL3.DQ17]
DQ18: D6.AM5(IO/CLK_3B_0n) ; harness DDR4_DL3.DQ18  [project net DDR4_BANK1.DL3.DQ18]
DQ19: D6.AP4(IO/PLL_3B_CLKOUT0p) ; harness DDR4_DL3.DQ19  [project net DDR4_BANK1.DL3.DQ19]
DQ20: D6.AU2(IO/LVDS3B_17n) ; harness DDR4_DL3.DQ20  [project net DDR4_BANK1.DL3.DQ20]
DQ21: D6.AT3(IO/LVDS3B_18n) ; harness DDR4_DL3.DQ21  [project net DDR4_BANK1.DL3.DQ21]
DQ22: D6.AP5(IO/PLL_3B_CLKOUT0n) ; harness DDR4_DL3.DQ22  [project net DDR4_BANK1.DL3.DQ22]
DQ23: D6.AP3(IO/LVDS3B_14n) ; harness DDR4_DL3.DQ23  [project net DDR4_BANK1.DL3.DQ23]
DQ24: D6.AH11(IO/LVDS3B_5p) ; harness DDR4_DL4.DQ24  [project net DDR4_BANK1.DL4.DQ24]
DQ25: D6.AH9(IO/LVDS3B_2n) ; harness DDR4_DL4.DQ25  [project net DDR4_BANK1.DL4.DQ25]
DQ26: D6.AH8(IO/LVDS3B_1n) ; harness DDR4_DL4.DQ26  [project net DDR4_BANK1.DL4.DQ26]
DQ27: D6.AF12(IO/LVDS3B_3n) ; harness DDR4_DL4.DQ27  [project net DDR4_BANK1.DL4.DQ27]
DQ28: D6.AG12(IO/LVDS3B_3p) ; harness DDR4_DL4.DQ28  [project net DDR4_BANK1.DL4.DQ28]
DQ29: D6.AJ10(IO/LVDS3B_6p) ; harness DDR4_DL4.DQ29  [project net DDR4_BANK1.DL4.DQ29]
DQ30: D6.AJ8(IO/LVDS3B_1p) ; harness DDR4_DL4.DQ30  [project net DDR4_BANK1.DL4.DQ30]
DQ31: D6.AG11(IO/LVDS3B_5n) ; harness DDR4_DL4.DQ31  [project net DDR4_BANK1.DL4.DQ31]
DQ32: D6.AE3(IO/LVDS3D_24n) ; harness DDR4_DL5.DQ32  [project net DDR4_BANK1.DL5.DQ32]
DQ33: D6.AF2(IO/LVDS3D_21n) ; harness DDR4_DL5.DQ33  [project net DDR4_BANK1.DL5.DQ33]
DQ34: D6.AE1(IO/LVDS3D_23p) ; harness DDR4_DL5.DQ34  [project net DDR4_BANK1.DL5.DQ34]
DQ35: D6.AC1(IO/LVDS3D_19n) ; harness DDR4_DL5.DQ35  [project net DDR4_BANK1.DL5.DQ35]
DQ36: D6.AF3(IO/LVDS3D_24p) ; harness DDR4_DL5.DQ36  [project net DDR4_BANK1.DL5.DQ36]
DQ37: D6.AG2(IO/LVDS3D_21p) ; harness DDR4_DL5.DQ37  [project net DDR4_BANK1.DL5.DQ37]
DQ38: D6.AE2(IO/LVDS3D_23n) ; harness DDR4_DL5.DQ38  [project net DDR4_BANK1.DL5.DQ38]
DQ39: D6.AD1(IO/LVDS3D_19p) ; harness DDR4_DL5.DQ39  [project net DDR4_BANK1.DL5.DQ39]
DQ40: D6.AC6(IO/LVDS3D_11n) ; harness DDR4_DL6.DQ40  [project net DDR4_BANK1.DL6.DQ40]
DQ41: D6.AD4(IO/LVDS3D_9p) ; harness DDR4_DL6.DQ41  [project net DDR4_BANK1.DL6.DQ41]
DQ42: D6.Y6(IO/LVDS3D_7p) ; harness DDR4_DL6.DQ42  [project net DDR4_BANK1.DL6.DQ42]
DQ43: D6.AB5(IO/CLK_3D_1p) ; harness DDR4_DL6.DQ43  [project net DDR4_BANK1.DL6.DQ43]
DQ44: D6.AA5(IO/LVDS3D_8p) ; harness DDR4_DL6.DQ44  [project net DDR4_BANK1.DL6.DQ44]
DQ45: D6.AD5(IO/LVDS3D_9n) ; harness DDR4_DL6.DQ45  [project net DDR4_BANK1.DL6.DQ45]
DQ46: D6.AB6(IO/CLK_3D_1n) ; harness DDR4_DL6.DQ46  [project net DDR4_BANK1.DL6.DQ46]
DQ47: D6.AD6(IO/RZQ_3D) ; harness DDR4_DL6.DQ47  [project net DDR4_BANK1.DL6.DQ47]
DQ48: D6.AB1(IO/LVDS3D_17p) ; harness DDR4_DL7.DQ48  [project net DDR4_BANK1.DL7.DQ48]
DQ49: D6.AB4(IO/PLL_3D_CLKOUT0p) ; harness DDR4_DL7.DQ49  [project net DDR4_BANK1.DL7.DQ49]
DQ50: D6.Y3(IO/CLK_3D_0n) ; harness DDR4_DL7.DQ50  [project net DDR4_BANK1.DL7.DQ50]
DQ51: D6.Y1(IO/LVDS3D_14p) ; harness DDR4_DL7.DQ51  [project net DDR4_BANK1.DL7.DQ51]
DQ52: D6.AC4(IO/LVDS3D_18n) ; harness DDR4_DL7.DQ52  [project net DDR4_BANK1.DL7.DQ52]
DQ53: D6.AB2(IO/LVDS3D_17n) ; harness DDR4_DL7.DQ53  [project net DDR4_BANK1.DL7.DQ53]
DQ54: D6.Y2(IO/CLK_3D_0p) ; harness DDR4_DL7.DQ54  [project net DDR4_BANK1.DL7.DQ54]
DQ55: D6.AA4(IO/PLL_3D_CLKOUT0n) ; harness DDR4_DL7.DQ55  [project net DDR4_BANK1.DL7.DQ55]
DQ56: D6.Y10(IO/LVDS3D_2n) ; harness DDR4_DL8.DQ56  [project net DDR4_BANK1.DL8.DQ56]
DQ57: D6.AB9(IO/LVDS3D_5p) ; harness DDR4_DL8.DQ57  [project net DDR4_BANK1.DL8.DQ57]
DQ58: D6.AB11(IO/LVDS3D_3n) ; harness DDR4_DL8.DQ58  [project net DDR4_BANK1.DL8.DQ58]
DQ59: D6.W8(IO/LVDS3D_1n) ; harness DDR4_DL8.DQ59  [project net DDR4_BANK1.DL8.DQ59]
DQ60: D6.AB7(IO/LVDS3D_6n) ; harness DDR4_DL8.DQ60  [project net DDR4_BANK1.DL8.DQ60]
DQ61: D6.AA9(IO/LVDS3D_2p) ; harness DDR4_DL8.DQ61  [project net DDR4_BANK1.DL8.DQ61]
DQ62: D6.AB10(IO/LVDS3D_5n) ; harness DDR4_DL8.DQ62  [project net DDR4_BANK1.DL8.DQ62]
DQ63: D6.Y8(IO/LVDS3D_1p) ; harness DDR4_DL8.DQ63  [project net DDR4_BANK1.DL8.DQ63]
DQS0_N: D6.AM7(IO/PLL_3B_CLKOUT1n) ; harness DDR4_DL1.DQS0_N  [project net DDR4_BANK1.DL1.DQS0_N]
DQS0_P: D6.AN7(IO/PLL_3B_CLKOUT1p) ; harness DDR4_DL1.DQS0_P  [project net DDR4_BANK1.DL1.DQS0_P]
DQS1_N: D6.AV6(IO/LVDS3B_22n) ; harness DDR4_DL2.DQS1_N  [project net DDR4_BANK1.DL2.DQS1_N]
DQS1_P: D6.AW6(IO/LVDS3B_22p) ; harness DDR4_DL2.DQS1_P  [project net DDR4_BANK1.DL2.DQS1_P]
DQS2_N: D6.AP6(IO/LVDS3B_16n) ; harness DDR4_DL3.DQS2_N  [project net DDR4_BANK1.DL3.DQS2_N]
DQS2_P: D6.AR5(IO/LVDS3B_16p) ; harness DDR4_DL3.DQS2_P  [project net DDR4_BANK1.DL3.DQS2_P]
DQS3_N: D6.AG10(IO/LVDS3B_4n) ; harness DDR4_DL4.DQS3_N  [project net DDR4_BANK1.DL4.DQS3_N]
DQS3_P: D6.AG9(IO/LVDS3B_4p) ; harness DDR4_DL4.DQS3_P  [project net DDR4_BANK1.DL4.DQS3_P]
DQS4_N: D6.AG1(IO/LVDS3D_22n) ; harness DDR4_DL5.DQS4_N  [project net DDR4_BANK1.DL5.DQS4_N]
DQS4_P: D6.AH1(IO/LVDS3D_22p) ; harness DDR4_DL5.DQS4_P  [project net DDR4_BANK1.DL5.DQS4_P]
DQS5_N: D6.AE6(IO/PLL_3D_CLKOUT1n) ; harness DDR4_DL6.DQS5_N  [project net DDR4_BANK1.DL6.DQS5_N]
DQS5_P: D6.AE5(IO/PLL_3D_CLKOUT1p) ; harness DDR4_DL6.DQS5_P  [project net DDR4_BANK1.DL6.DQS5_P]
DQS6_N: D6.AA3(IO/LVDS3D_16n) ; harness DDR4_DL7.DQS6_N  [project net DDR4_BANK1.DL7.DQS6_N]
DQS6_P: D6.AA2(IO/LVDS3D_16p) ; harness DDR4_DL7.DQS6_P  [project net DDR4_BANK1.DL7.DQS6_P]
DQS7_N: D6.AA8(IO/LVDS3D_4n) ; harness DDR4_DL8.DQS7_N  [project net DDR4_BANK1.DL8.DQS7_N]
DQS7_P: D6.AA7(IO/LVDS3D_4p) ; harness DDR4_DL8.DQS7_P  [project net DDR4_BANK1.DL8.DQS7_P]
ODT0: D6.AK12(IO/LVDS3A_14n) ; harness CTRL_SODIMM.ODT
ODT1: D6.AR12(IO/LVDS3A_11n) ; harness CTRL_SODIMM.ODT
PARITY: D6.AP9(IO/LVDS3A_9p) ; harness CTRL_SODIMM.PARITY
RESET: D6.AW10(IO/LVDS3A_6n) ; harness CTRL_SODIMM.RESET
SA0: D6.AN12(IO/LVDS3A_18p)  [project net SA0_26]
SA1: D6.AL13(IO/LVDS3A_17p)  [project net SA1_26]
SA2: D6.AM12(IO/PLL_3A_CLKOUT0p)  [project net SA2_26]
SCL: D6.AN13(IO/LVDS3A_18n) ; harness CTRL_SODIMM.SCL
SDA: D6.AL12(IO/PLL_3A_CLKOUT0n) ; harness CTRL_SODIMM.SDA
NetD6_AH7: D6.AH7(IO/RZQ_3C) R63.2

Not connected (* = marked no-connect by the designer): D6 AC2(IO/LVDS3D_20p) AC3(IO/LVDS3D_18p) AC7(IO/LVDS3D_6p) AC8(IO/LVDS3C_1p) AC9(IO/LVDS3C_1n) AC11(IO/LVDS3C_5n) AD8(IO/LVDS3C_3p) AD9(IO/LVDS3C_3n) AD10(IO/LVDS3C_5p) AE7(IO/LVDS3C_9n) AE10(IO/LVDS3C_2p) AE11(IO/LVDS3C_2n) AF7(IO/LVDS3C_9p) AF9(IO/LVDS3C_6p) AF10(IO/LVDS3C_6n) AF14(IO/LVDS3A_22n) AF15(IO/LVDS3A_24n) AG5(IO/CLK_3C_1p) AG6(IO/CLK_3C_1n) AG14(IO/LVDS3A_22p) AG15(IO/LVDS3A_24p) AH6(IO/CLK_3C_0n) AH12(IO/LVDS3A_20p) AH13(IO/LVDS3A_20n) AH14(IO/LVDS3A_23n) AJ5(IO/CLK_3C_0p) AJ6(IO/PLL_3C_CLKOUT0n) AJ11(IO/LVDS3B_6n) AJ13(IO/LVDS3A_21n) AJ14(IO/LVDS3A_23p) AJ15(IO/LVDS3A_19n) AK6(IO/PLL_3C_CLKOUT0p) AK13(IO/LVDS3A_21p) AK15(IO/LVDS3A_19p) AL2(IO/LVDS3C_23n) AL14(IO/LVDS3A_17n) AM2(IO/LVDS3C_23p) AM11(IO/LVDS3A_16n) AN2(IO/LVDS3C_24n) AN8(IO/RZQ_3B) AN11(IO/LVDS3A_16p) AP1(IO/LVDS3C_24p) AP10(IO/PLL_3A_CLKOUT1n) AR7(IO/LVDS3B_20n) AR10(IO/PLL_3A_CLKOUT1p) AR11(IO/CLK_3A_1p) AT2(IO/LVDS3B_18p) AT7(IO/LVDS3A_2p) AT8(IO/LVDS3A_2n) AT9(IO/LVDS3A_3p) AT10(IO/LVDS3A_3n) AT12(IO/RZQ_3A) AU7(IO/LVDS3A_1n) AU10(IO/LVDS3A_8p) AU11(IO/LVDS3A_8n) AV7(IO/LVDS3A_1p) AV8(IO/LVDS3A_4n) AW8(IO/LVDS3A_4p) Y7(IO/LVDS3D_7n)

### Buses and harness runs
bus A[0..16]
bus BA[0..1]
bus BG[0..1]
bus SA[0..2]
harness DDR4_BANK1 = port BANK1
harness DDR4_BANK2 = port BANK2

### Notes on the sheet
- Подп. дата
- Инв. № дубл.
- Взам. инв. №
- Подп. и дата
- Инв. № подл.
- Изм.
- Лист
- № докум.
- Подп.
- Дата
- ALTIUM GOSTBOM2.0 KEV
- Файл:
- Копировал
- Формат А2
- (in symbol E105, part F) PLMMPU; BANK 3A
- (in symbol E105, part G) PLMMPU; BANK 3B
- (in symbol E105, part H) PLMMPU; BANK 3C
- (in symbol E105, part I) PLMMPU; BANK 3D

### Library data of the parts
D6 = E105: Arria 10 SX Family, 588 I/O Pins, 16 Fractional PLLs, 1517-Pin FBGA, Speed Grade 2, Extended Grade, RoHS; Тип элемента: ПЛИС; Old_des: U1; New_des: D6; UID: E105; Component Kind: Standard; ComponentLink1Description: Manufacturer URL; ComponentLink1URL: https://www.altera.com/; ComponentLink2Description: Datasheet; ComponentLink2URL: https://www.altera.com/content/dam/altera-www/global/en_US/pdfs/literature/hb/arria-10/a10_datasheet.pdf; DatasheetVersion: Rev. 2016-06-24, 06/2016; Mounting Technology: Surface Mount; PackageDescription: 1517-Pin FineLine Ball-Grid Array (FBGA), Body 40 x 40 mm, Pitch 1 mm; PartNumber: 10AS066N3F40E2SGE2; Code_JEDEC: MS-034; ComponentLink3Description: Package Specification; ComponentLink3URL: https://www.altera.com/content/dam/altera-www/global/en_US/pdfs/literature/packaging/04r00461-04.pdf; PackageVersion: Rev. 5.0, 01/2016
R59 = E97: Chip Resistor, 39 Ohm, +/- 5%, 0.063 W, -55 to 155 degC, 0402 (1005 Metric), RoHS, Tape and Reel; Тип элемента: Резистор; Voltage Rating: 50 V; Power Rating: 63 mW; Resistance: 39 Ohm; Old_des: R239; New_des: R59; UID: E97; Component Kind: Standard; Case Code (Imperial): 0402; Case Code (Metric): 1005; Case/Package: 0402; ComponentLink1Description: Manufacturer URL; ComponentLink1URL: http://www.yageo.com/; ComponentLink2Description: Datasheet; ComponentLink2URL: http://www.yageo.com/documents/recent/PYu-RC_Group_51_RoHS_L_04.pdf; DatasheetVersion: Rev. 4, 02/2016; Length: 1 mm; Max Operating Temperature: 155 degC; Min Operating Temperature: -55 degC; Mounting Technology: Surface Mount; Package Quantity: 1; PackageDescription: 2-Pin Surface Mount Device, Body 1 x 0.5 mm; Packaging: Cut Tape; PartNumber: RC0402JR-0739RL; RoHSCompliant: true; Tolerance: 5%; Width: 0.5 mm; Height: 0.35 mm; Mount: Surface Mount; Pins: 2; REACH SVHC: No SVHC; Voltage Rating (DC): 50 V
R60 = E97: Chip Resistor, 39 Ohm, +/- 5%, 0.063 W, -55 to 155 degC, 0402 (1005 Metric), RoHS, Tape and Reel; Тип элемента: Резистор; Voltage Rating: 50 V; Power Rating: 63 mW; Resistance: 39 Ohm; Old_des: R240; New_des: R60; UID: E97; Component Kind: Standard; Case Code (Imperial): 0402; Case Code (Metric): 1005; Case/Package: 0402; ComponentLink1Description: Manufacturer URL; ComponentLink1URL: http://www.yageo.com/; ComponentLink2Description: Datasheet; ComponentLink2URL: http://www.yageo.com/documents/recent/PYu-RC_Group_51_RoHS_L_04.pdf; DatasheetVersion: Rev. 4, 02/2016; Length: 1 mm; Max Operating Temperature: 155 degC; Min Operating Temperature: -55 degC; Mounting Technology: Surface Mount; Package Quantity: 1; PackageDescription: 2-Pin Surface Mount Device, Body 1 x 0.5 mm; Packaging: Cut Tape; PartNumber: RC0402JR-0739RL; RoHSCompliant: true; Tolerance: 5%; Width: 0.5 mm; Height: 0.35 mm; Mount: Surface Mount; Pins: 2; REACH SVHC: No SVHC; Voltage Rating (DC): 50 V
R61 = E97: Chip Resistor, 39 Ohm, +/- 5%, 0.063 W, -55 to 155 degC, 0402 (1005 Metric), RoHS, Tape and Reel; Тип элемента: Резистор; Voltage Rating: 50 V; Power Rating: 63 mW; Resistance: 39 Ohm; Old_des: R238; New_des: R61; UID: E97; Component Kind: Standard; Case Code (Imperial): 0402; Case Code (Metric): 1005; Case/Package: 0402; ComponentLink1Description: Manufacturer URL; ComponentLink1URL: http://www.yageo.com/; ComponentLink2Description: Datasheet; ComponentLink2URL: http://www.yageo.com/documents/recent/PYu-RC_Group_51_RoHS_L_04.pdf; DatasheetVersion: Rev. 4, 02/2016; Length: 1 mm; Max Operating Temperature: 155 degC; Min Operating Temperature: -55 degC; Mounting Technology: Surface Mount; Package Quantity: 1; PackageDescription: 2-Pin Surface Mount Device, Body 1 x 0.5 mm; Packaging: Cut Tape; PartNumber: RC0402JR-0739RL; RoHSCompliant: true; Tolerance: 5%; Width: 0.5 mm; Height: 0.35 mm; Mount: Surface Mount; Pins: 2; REACH SVHC: No SVHC; Voltage Rating (DC): 50 V
R62 = E97: Chip Resistor, 39 Ohm, +/- 5%, 0.063 W, -55 to 155 degC, 0402 (1005 Metric), RoHS, Tape and Reel; Тип элемента: Резистор; Voltage Rating: 50 V; Power Rating: 63 mW; Resistance: 39 Ohm; Old_des: R241; New_des: R62; UID: E97; Component Kind: Standard; Case Code (Imperial): 0402; Case Code (Metric): 1005; Case/Package: 0402; ComponentLink1Description: Manufacturer URL; ComponentLink1URL: http://www.yageo.com/; ComponentLink2Description: Datasheet; ComponentLink2URL: http://www.yageo.com/documents/recent/PYu-RC_Group_51_RoHS_L_04.pdf; DatasheetVersion: Rev. 4, 02/2016; Length: 1 mm; Max Operating Temperature: 155 degC; Min Operating Temperature: -55 degC; Mounting Technology: Surface Mount; Package Quantity: 1; PackageDescription: 2-Pin Surface Mount Device, Body 1 x 0.5 mm; Packaging: Cut Tape; PartNumber: RC0402JR-0739RL; RoHSCompliant: true; Tolerance: 5%; Width: 0.5 mm; Height: 0.35 mm; Mount: Surface Mount; Pins: 2; REACH SVHC: No SVHC; Voltage Rating (DC): 50 V
R63 = E97: Chip Resistor, 39 Ohm, +/- 5%, 0.063 W, -55 to 155 degC, 0402 (1005 Metric), RoHS, Tape and Reel; Тип элемента: Резистор; Voltage Rating: 50 V; Power Rating: 63 mW; Resistance: 39 Ohm; Old_des: R237; New_des: R63; UID: E97; Component Kind: Standard; Case Code (Imperial): 0402; Case Code (Metric): 1005; Case/Package: 0402; ComponentLink1Description: Manufacturer URL; ComponentLink1URL: http://www.yageo.com/; ComponentLink2Description: Datasheet; ComponentLink2URL: http://www.yageo.com/documents/recent/PYu-RC_Group_51_RoHS_L_04.pdf; DatasheetVersion: Rev. 4, 02/2016; Length: 1 mm; Max Operating Temperature: 155 degC; Min Operating Temperature: -55 degC; Mounting Technology: Surface Mount; Package Quantity: 1; PackageDescription: 2-Pin Surface Mount Device, Body 1 x 0.5 mm; Packaging: Cut Tape; PartNumber: RC0402JR-0739RL; RoHSCompliant: true; Tolerance: 5%; Width: 0.5 mm; Height: 0.35 mm; Mount: Surface Mount; Pins: 2; REACH SVHC: No SVHC; Voltage Rating (DC): 50 V

## Sheet P_DP_REFCLK_SFP.SchDoc
size 420 x 297 mm; Author: ALTIUM GOSTBOM2.0 KEV; SheetNumber: 20; SheetTotal: 48
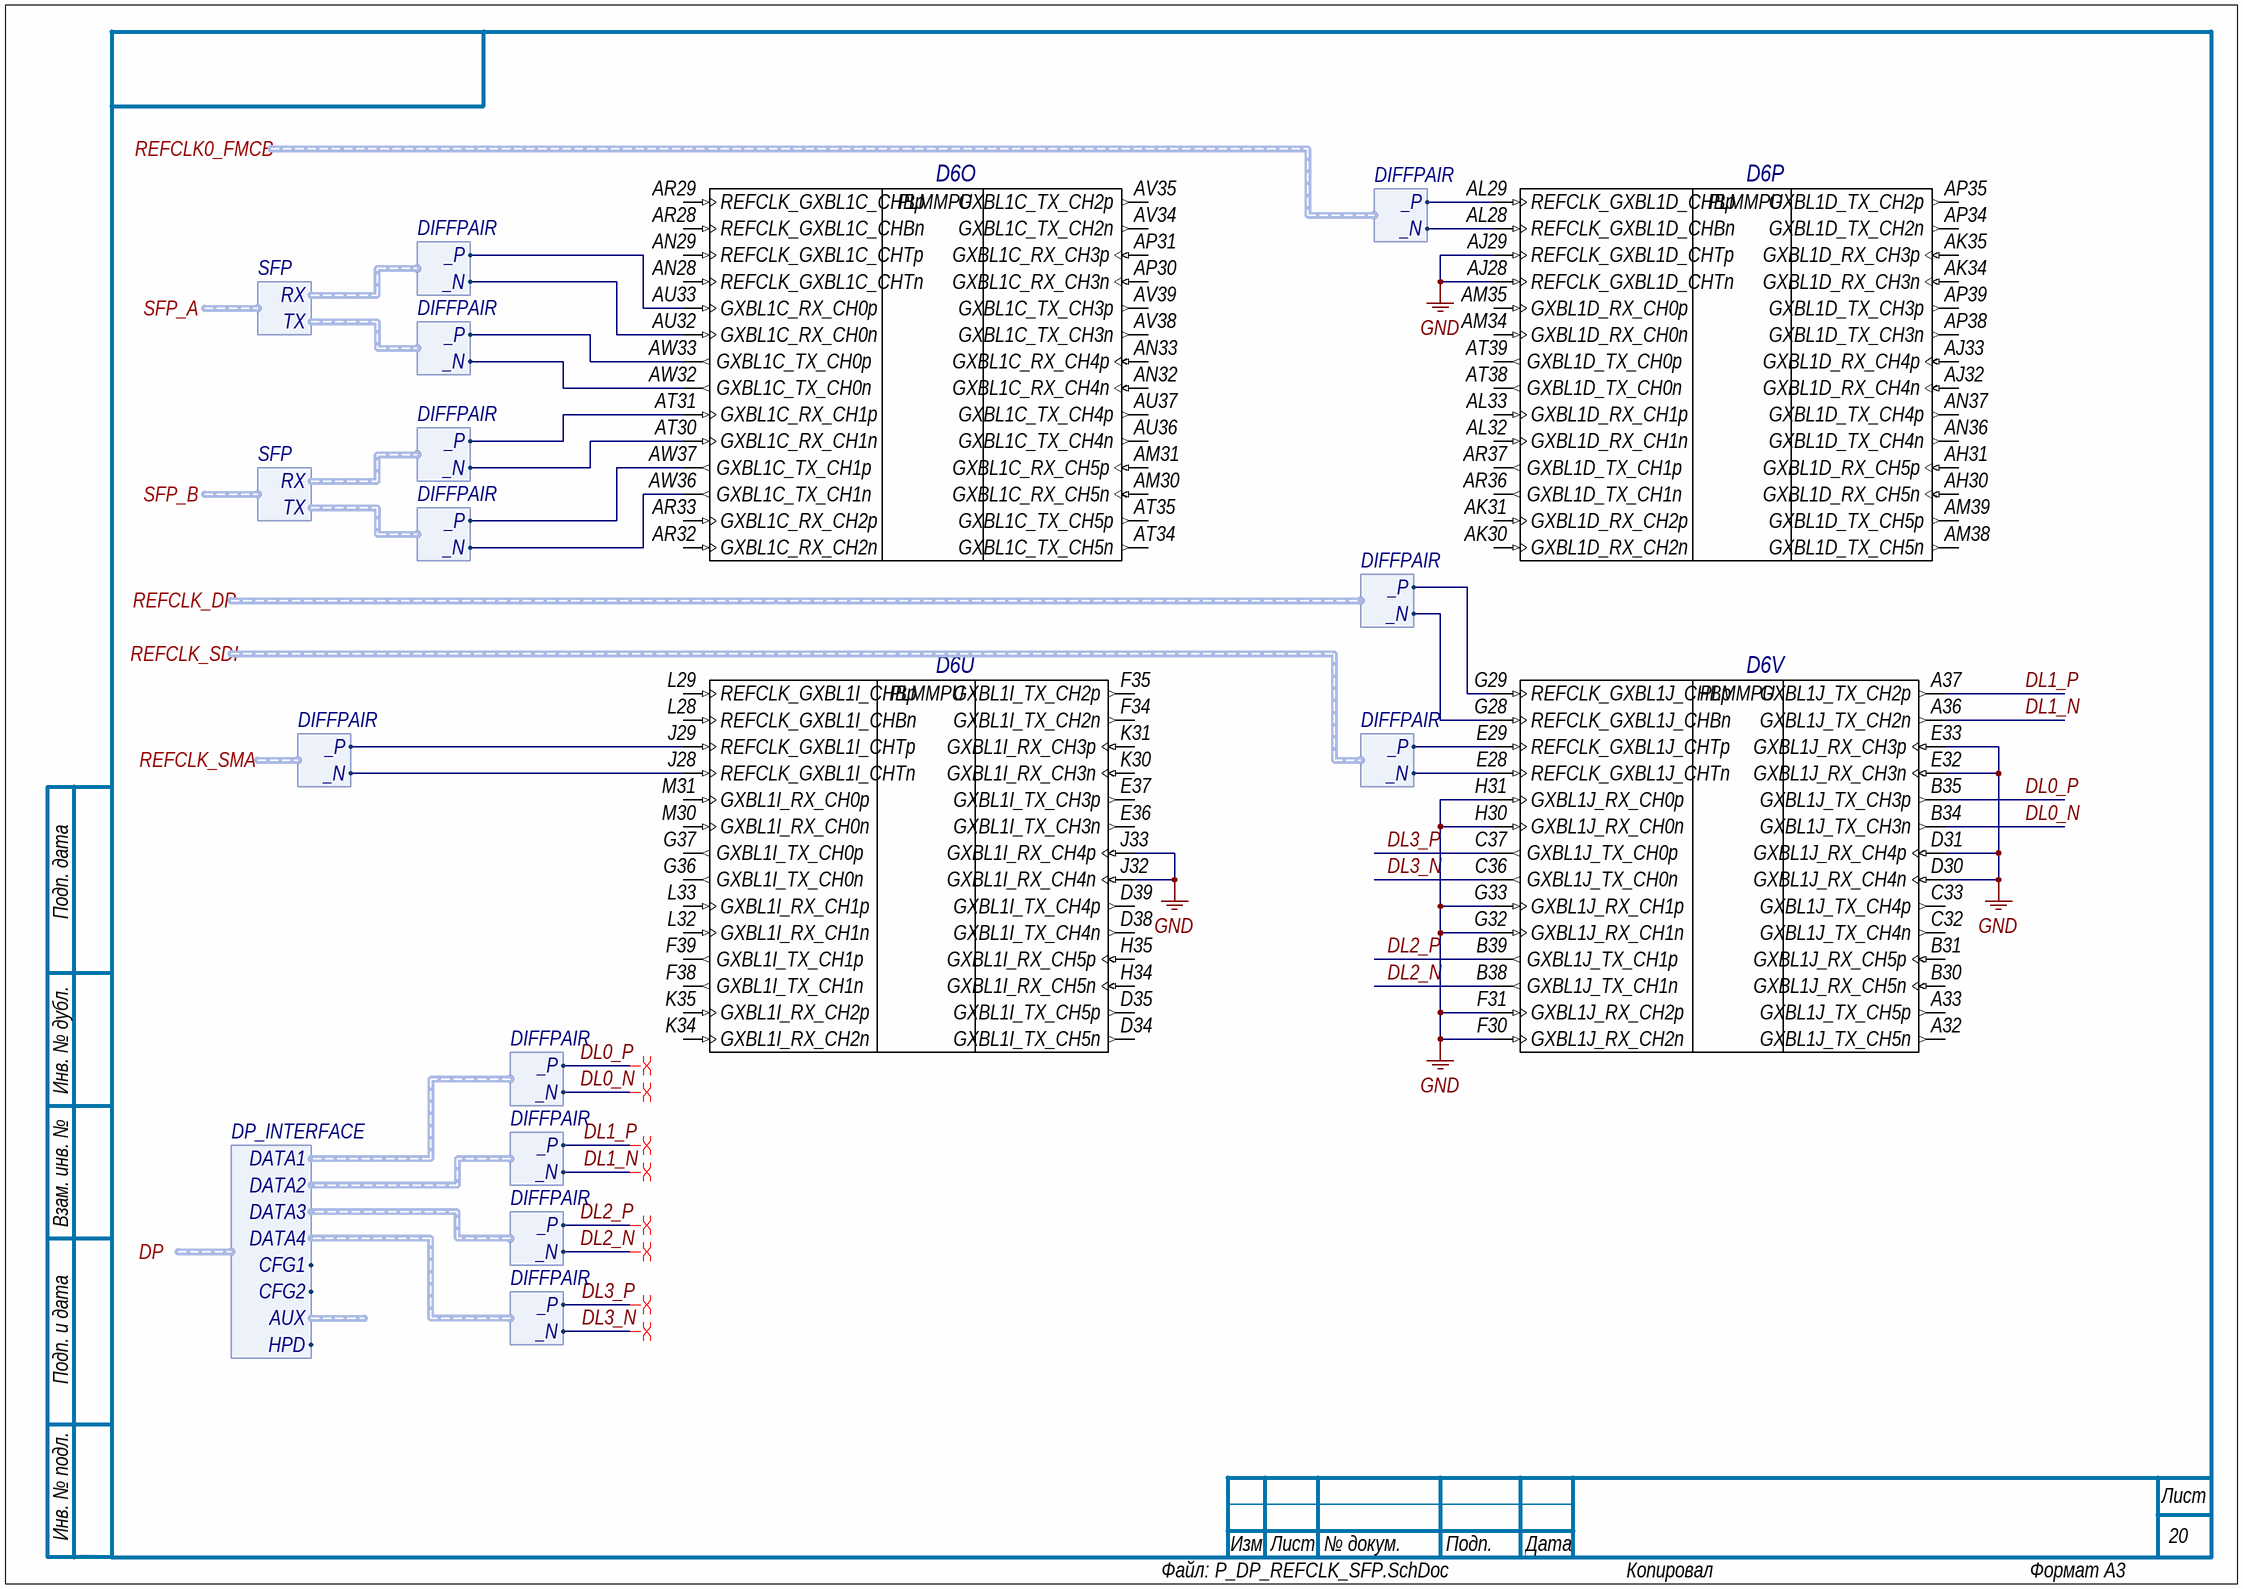
[diagram p39: P_DP_REFCLK_SFP.SchDoc]

### Parts
D6  10AS066N3F40E2SGE2  [ALTR-FBGA1517_A-350]  (value not drawn)  (parts O,P,U,V of 39)

### Ports
DP (harness DP_INTERFACE), REFCLK0_FMCB (harness DIFFPAIR), REFCLK_DP (harness DIFFPAIR), REFCLK_SDI (harness DIFFPAIR), REFCLK_SMA (harness DIFFPAIR), SFP_A (harness SFP), SFP_B (harness SFP)

### Harnesses
SFP: RX, TX
DIFFPAIR: _P, _N
DP_INTERFACE: DATA1, DATA2, DATA3, DATA4, CFG1, CFG2, AUX, HPD

### Nets
GND: D6.AJ28(REFCLK_GXBL1D_CHTn) D6.AJ29(REFCLK_GXBL1D_CHTp) D6.D30(GXBL1J_RX_CH4n) D6.D31(GXBL1J_RX_CH4p) D6.E32(GXBL1J_RX_CH3n) D6.E33(GXBL1J_RX_CH3p) D6.F30(GXBL1J_RX_CH2n) D6.F31(GXBL1J_RX_CH2p) D6.G32(GXBL1J_RX_CH1n) D6.G33(GXBL1J_RX_CH1p) D6.H30(GXBL1J_RX_CH0n) D6.H31(GXBL1J_RX_CH0p) D6.J32(GXBL1I_RX_CH4n) D6.J33(GXBL1I_RX_CH4p)
DL0_N: D6.B34(GXBL1J_TX_CH3n) ; harness DIFFPAIR._N
DL0_P: D6.B35(GXBL1J_TX_CH3p) ; harness DIFFPAIR._P
DL1_N: D6.A36(GXBL1J_TX_CH2n) ; harness DIFFPAIR._N
DL1_P: D6.A37(GXBL1J_TX_CH2p) ; harness DIFFPAIR._P
DL2_N: D6.B38(GXBL1J_TX_CH1n) ; harness DIFFPAIR._N
DL2_P: D6.B39(GXBL1J_TX_CH1p) ; harness DIFFPAIR._P
DL3_N: D6.C36(GXBL1J_TX_CH0n) ; harness DIFFPAIR._N
DL3_P: D6.C37(GXBL1J_TX_CH0p) ; harness DIFFPAIR._P
NetD6_AL28: D6.AL28(REFCLK_GXBL1D_CHBn) ; port REFCLK0_FMCB._N
NetD6_AL29: D6.AL29(REFCLK_GXBL1D_CHBp) ; port REFCLK0_FMCB._P
NetD6_AT30: D6.AT30(GXBL1C_RX_CH1n) ; harness DIFFPAIR._N
NetD6_AT31: D6.AT31(GXBL1C_RX_CH1p) ; harness DIFFPAIR._P
NetD6_AU32: D6.AU32(GXBL1C_RX_CH0n) ; harness DIFFPAIR._N
NetD6_AU33: D6.AU33(GXBL1C_RX_CH0p) ; harness DIFFPAIR._P
NetD6_AW32: D6.AW32(GXBL1C_TX_CH0n) ; harness DIFFPAIR._N
NetD6_AW33: D6.AW33(GXBL1C_TX_CH0p) ; harness DIFFPAIR._P
NetD6_AW36: D6.AW36(GXBL1C_TX_CH1n) ; harness DIFFPAIR._N
NetD6_AW37: D6.AW37(GXBL1C_TX_CH1p) ; harness DIFFPAIR._P
NetD6_E28: D6.E28(REFCLK_GXBL1J_CHTn) ; port REFCLK_SDI._N
NetD6_E29: D6.E29(REFCLK_GXBL1J_CHTp) ; port REFCLK_SDI._P
NetD6_G28: D6.G28(REFCLK_GXBL1J_CHBn) ; port REFCLK_DP._N
NetD6_G29: D6.G29(REFCLK_GXBL1J_CHBp) ; port REFCLK_DP._P
NetD6_J28: D6.J28(REFCLK_GXBL1I_CHTn) ; port REFCLK_SMA._N
NetD6_J29: D6.J29(REFCLK_GXBL1I_CHTp) ; port REFCLK_SMA._P

Not connected (* = marked no-connect by the designer): D6 A32(GXBL1J_TX_CH5n) A33(GXBL1J_TX_CH5p) AH30(GXBL1D_RX_CH5n) AH31(GXBL1D_RX_CH5p) AJ32(GXBL1D_RX_CH4n) AJ33(GXBL1D_RX_CH4p) AK30(GXBL1D_RX_CH2n) AK31(GXBL1D_RX_CH2p) AK34(GXBL1D_RX_CH3n) AK35(GXBL1D_RX_CH3p) AL32(GXBL1D_RX_CH1n) AL33(GXBL1D_RX_CH1p) AM30(GXBL1C_RX_CH5n) AM31(GXBL1C_RX_CH5p) AM34(GXBL1D_RX_CH0n) AM35(GXBL1D_RX_CH0p) AM38(GXBL1D_TX_CH5n) AM39(GXBL1D_TX_CH5p) AN28(REFCLK_GXBL1C_CHTn) AN29(REFCLK_GXBL1C_CHTp) AN32(GXBL1C_RX_CH4n) AN33(GXBL1C_RX_CH4p) AN36(GXBL1D_TX_CH4n) AN37(GXBL1D_TX_CH4p) AP30(GXBL1C_RX_CH3n) AP31(GXBL1C_RX_CH3p) AP34(GXBL1D_TX_CH2n) AP35(GXBL1D_TX_CH2p) AP38(GXBL1D_TX_CH3n) AP39(GXBL1D_TX_CH3p) AR28(REFCLK_GXBL1C_CHBn) AR29(REFCLK_GXBL1C_CHBp) AR32(GXBL1C_RX_CH2n) AR33(GXBL1C_RX_CH2p) AR36(GXBL1D_TX_CH1n) AR37(GXBL1D_TX_CH1p) AT34(GXBL1C_TX_CH5n) AT35(GXBL1C_TX_CH5p) AT38(GXBL1D_TX_CH0n) AT39(GXBL1D_TX_CH0p) AU36(GXBL1C_TX_CH4n) AU37(GXBL1C_TX_CH4p) AV34(GXBL1C_TX_CH2n) AV35(GXBL1C_TX_CH2p) AV38(GXBL1C_TX_CH3n) AV39(GXBL1C_TX_CH3p) B30(GXBL1J_RX_CH5n) B31(GXBL1J_RX_CH5p) C32(GXBL1J_TX_CH4n) C33(GXBL1J_TX_CH4p) D34(GXBL1I_TX_CH5n) D35(GXBL1I_TX_CH5p) D38(GXBL1I_TX_CH4n) D39(GXBL1I_TX_CH4p) E36(GXBL1I_TX_CH3n) E37(GXBL1I_TX_CH3p) F34(GXBL1I_TX_CH2n) F35(GXBL1I_TX_CH2p) F38(GXBL1I_TX_CH1n) F39(GXBL1I_TX_CH1p) G36(GXBL1I_TX_CH0n) G37(GXBL1I_TX_CH0p) H34(GXBL1I_RX_CH5n) H35(GXBL1I_RX_CH5p) K30(GXBL1I_RX_CH3n) K31(GXBL1I_RX_CH3p) K34(GXBL1I_RX_CH2n) K35(GXBL1I_RX_CH2p) L28(REFCLK_GXBL1I_CHBn) L29(REFCLK_GXBL1I_CHBp) L32(GXBL1I_RX_CH1n) L33(GXBL1I_RX_CH1p) M30(GXBL1I_RX_CH0n) M31(GXBL1I_RX_CH0p)

### Layout directives
differential pair: DL0_N, DL0_P, DL1_N, DL1_P, DL2_N, DL2_P, DL3_N, DL3_P

### Notes on the sheet
- Подп. дата
- Инв. № дубл.
- Взам. инв. №
- Подп. и дата
- Инв. № подл.
- Изм.
- Лист
- № докум.
- Подп.
- Дата
- ALTIUM GOSTBOM2.0 KEV
- Файл:
- Копировал
- Формат А3
- (in symbol E105, part O) PLMMPU
- (in symbol E105, part P) PLMMPU
- (in symbol E105, part U) PLMMPU
- (in symbol E105, part V) PLMMPU

### Library data of the parts
D6 = E105: as D6 on sheet P_RAM_aux; UID: E105; Component Kind: Standard; ComponentLink1Description: Manufacturer URL; ComponentLink1URL: https://www.altera.com/; ComponentLink2Description: Datasheet; ComponentLink2URL: https://www.altera.com/content/dam/altera-www/global/en_US/pdfs/literature/hb/arria-10/a10_datasheet.pdf; DatasheetVersion: Rev. 2016-06-24, 06/2016; Mounting Technology: Surface Mount; PackageDescription: 1517-Pin FineLine Ball-Grid Array (FBGA), Body 40 x 40 mm, Pitch 1 mm; PartNumber: 10AS066N3F40E2SGE2; Code_JEDEC: MS-034; ComponentLink3Description: Package Specification; ComponentLink3URL: https://www.altera.com/content/dam/altera-www/global/en_US/pdfs/literature/packaging/04r00461-04.pdf; PackageVersion: Rev. 5.0, 01/2016